# EAGLE schematic CCM_0015_Precision_HV_Amplifier (EAGLE 8.6.0)

## Sheet 1 of 2: CCM Subrack Bus
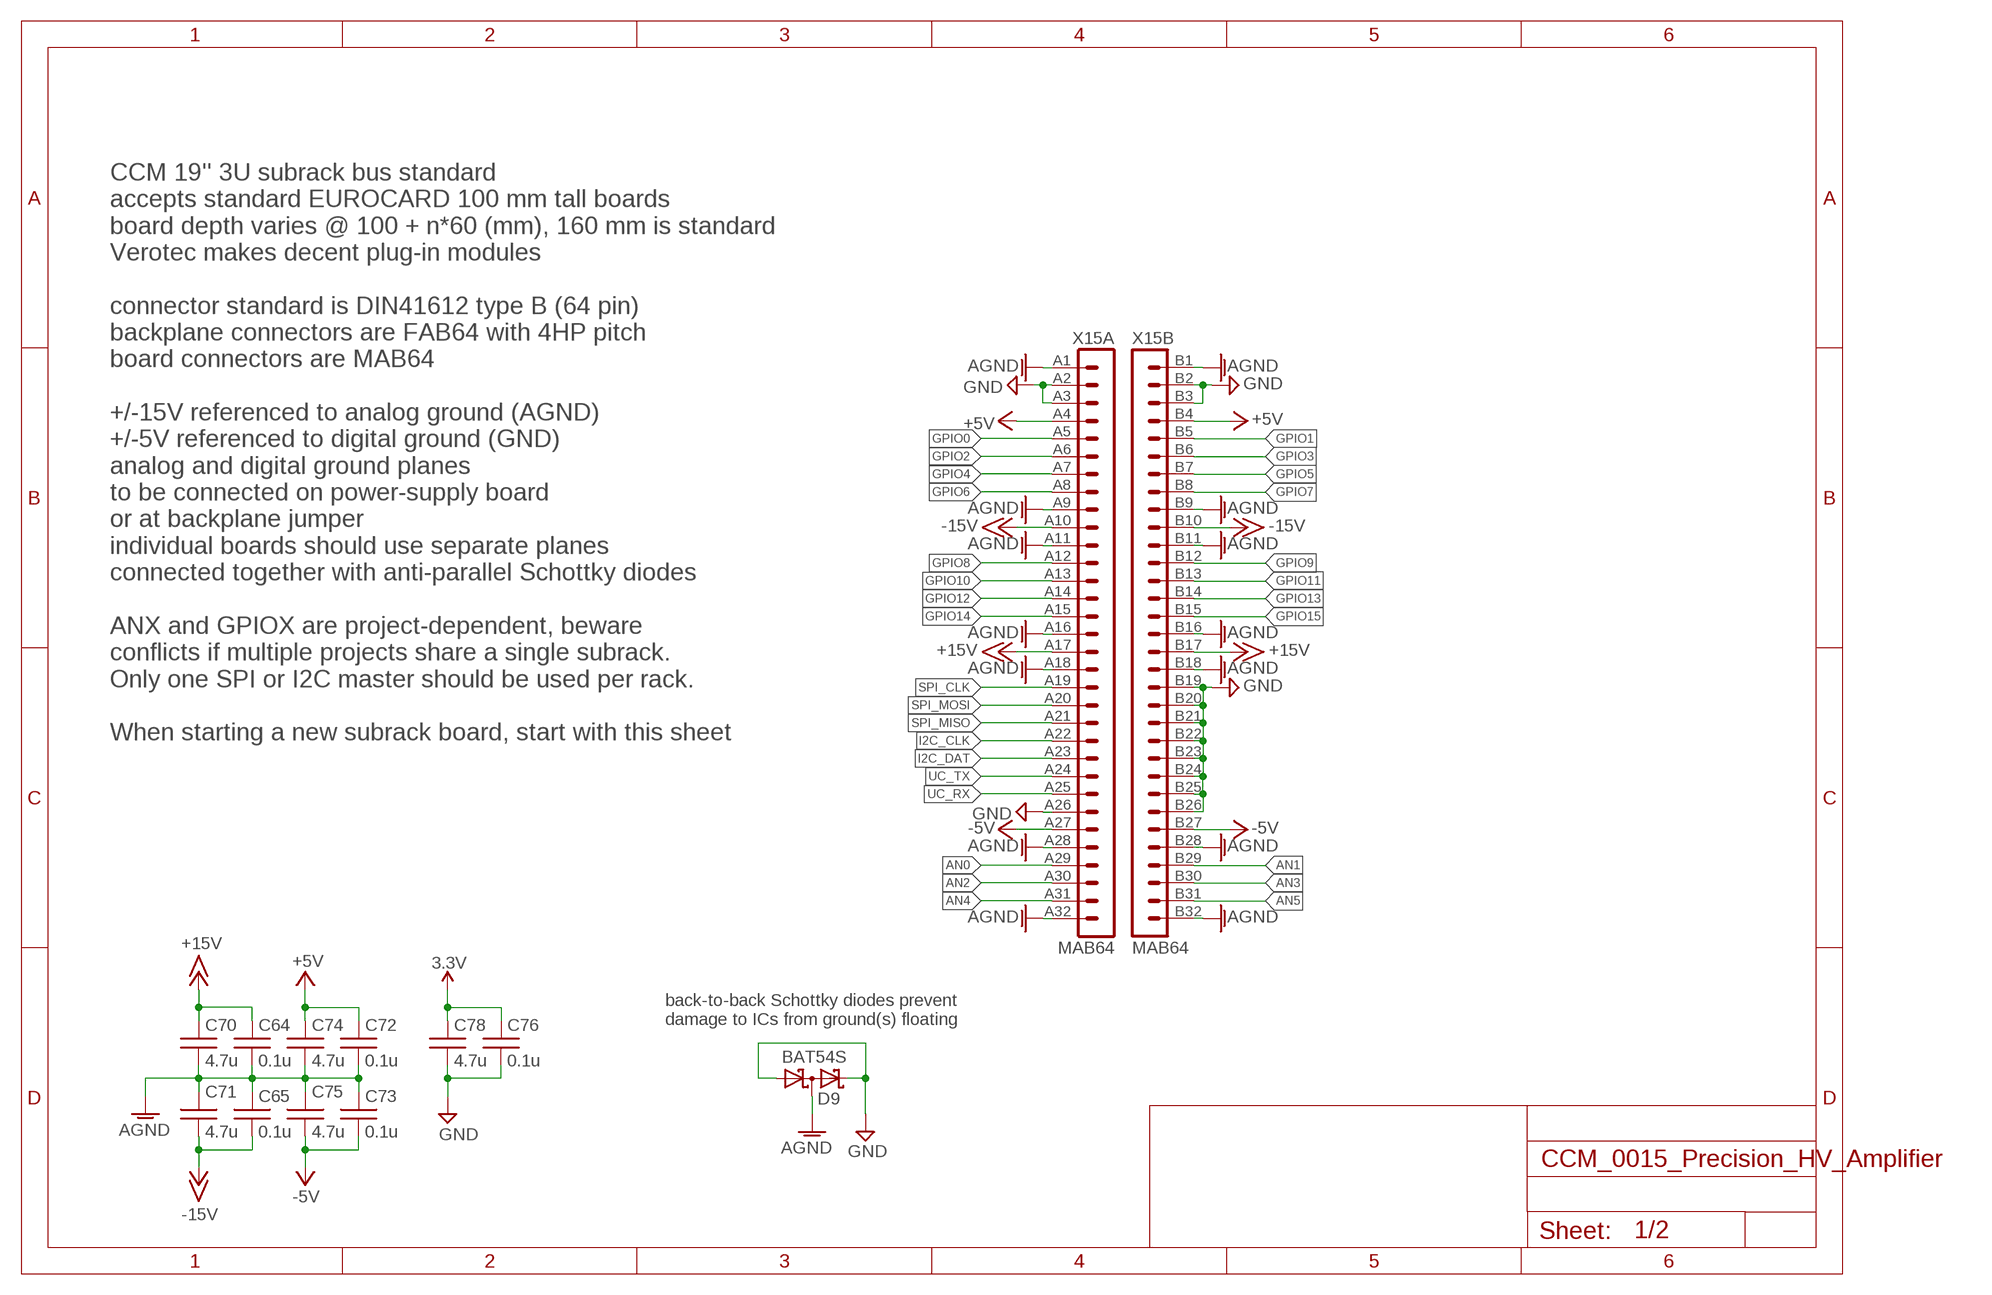
[diagram p0: schematic, sheet 1]

### Parts
C64  0.1u  C0603  [0603]
C65  0.1u  C0603  [0603]
C70  4.7u  C0603  [0603]
C71  4.7u  C0603  [0603]
C72  0.1u  C0603  [0603]
C73  0.1u  C0603  [0603]
C74  4.7u  C0603  [0603]
C75  4.7u  C0603  [0603]
C76  0.1u  C0603  [0603]
C78  4.7u  C0603  [0603]
D9  BAT54S  [SOT23]
X15  MAB64  [MAB64]

### Nets
3.3V: C76.1 C78.1
+5V: C72.1 C74.1 X15.A4 X15.B4
+15V: C64.1 C70.1 X15.A17 X15.B17 ; also sheet 2
-5V: C73.2 C75.2 X15.A27 X15.B27
-15V: C65.2 C71.2 X15.A10 X15.B10 ; also sheet 2
AGND: C64.2 C65.1 C70.2 C71.1 D9.3(C1A2) X15.A1 X15.A9 X15.A11 X15.A16 X15.A18 X15.A28 X15.A32 X15.B1 X15.B9 X15.B11 X15.B16 X15.B18 X15.B28 X15.B32 ; also sheet 2
AGND1: C72.2 C73.1 C74.2 C75.1
AN0: X15.A29
AN1: X15.B29
AN2: X15.A30
AN3: X15.B30
AN4: X15.A31
AN5: X15.B31
GND: C76.2 C78.2 D9.1(A1) D9.2(C2) X15.A2 X15.A3 X15.A26 X15.B2 X15.B3 X15.B19 X15.B20 X15.B21 X15.B22 X15.B23 X15.B24 X15.B25 X15.B26
GPIO0: X15.A5
GPIO1: X15.B5
GPIO2: X15.A6
GPIO3: X15.B6
GPIO4: X15.A7
GPIO5: X15.B7
GPIO6: X15.A8
GPIO7: X15.B8
GPIO8: X15.A12
GPIO9: X15.B12
GPIO10: X15.A13
GPIO11: X15.B13
GPIO12: X15.A14
GPIO13: X15.B14
GPIO14: X15.A15
GPIO15: X15.B15
I2C_CLK: X15.A22
I2C_DAT: X15.A23
SPI_CLK: X15.A19
SPI_MISO: X15.A21
SPI_MOSI: X15.A20
UC_RX: X15.A25
UC_TX: X15.A24

### Notes on the sheet
- CCM 19'' 3U subrack bus standard
  accepts standard EUROCARD 100 mm tall boards
  board depth varies @ 100 + n*60 (mm), 160 mm is standard
  Verotec makes decent plug-in modules
  
  connector standard is DIN41612 type B (64 pin)
  backplane connectors are FAB64 with 4HP pitch 
  board connectors are MAB64
  
  +/-15V referenced to analog ground (AGND)
  +/-5V referenced to digital ground (GND)
  analog and digital ground planes
  to be connected on power-supply board
  or at backplane jumper
  individual boards should use separate planes
  connected together with anti-parallel Schottky diodes
  
  ANX and GPIOX are project-dependent, beware 
  conflicts if multiple projects share a single subrack.
  Only one SPI or I2C master should be used per rack.
  
  When starting a new subrack board, start with this sheet
- back-to-back Schottky diodes prevent 
  damage to ICs from ground(s) floating

## Sheet 2 of 2: cavity drive
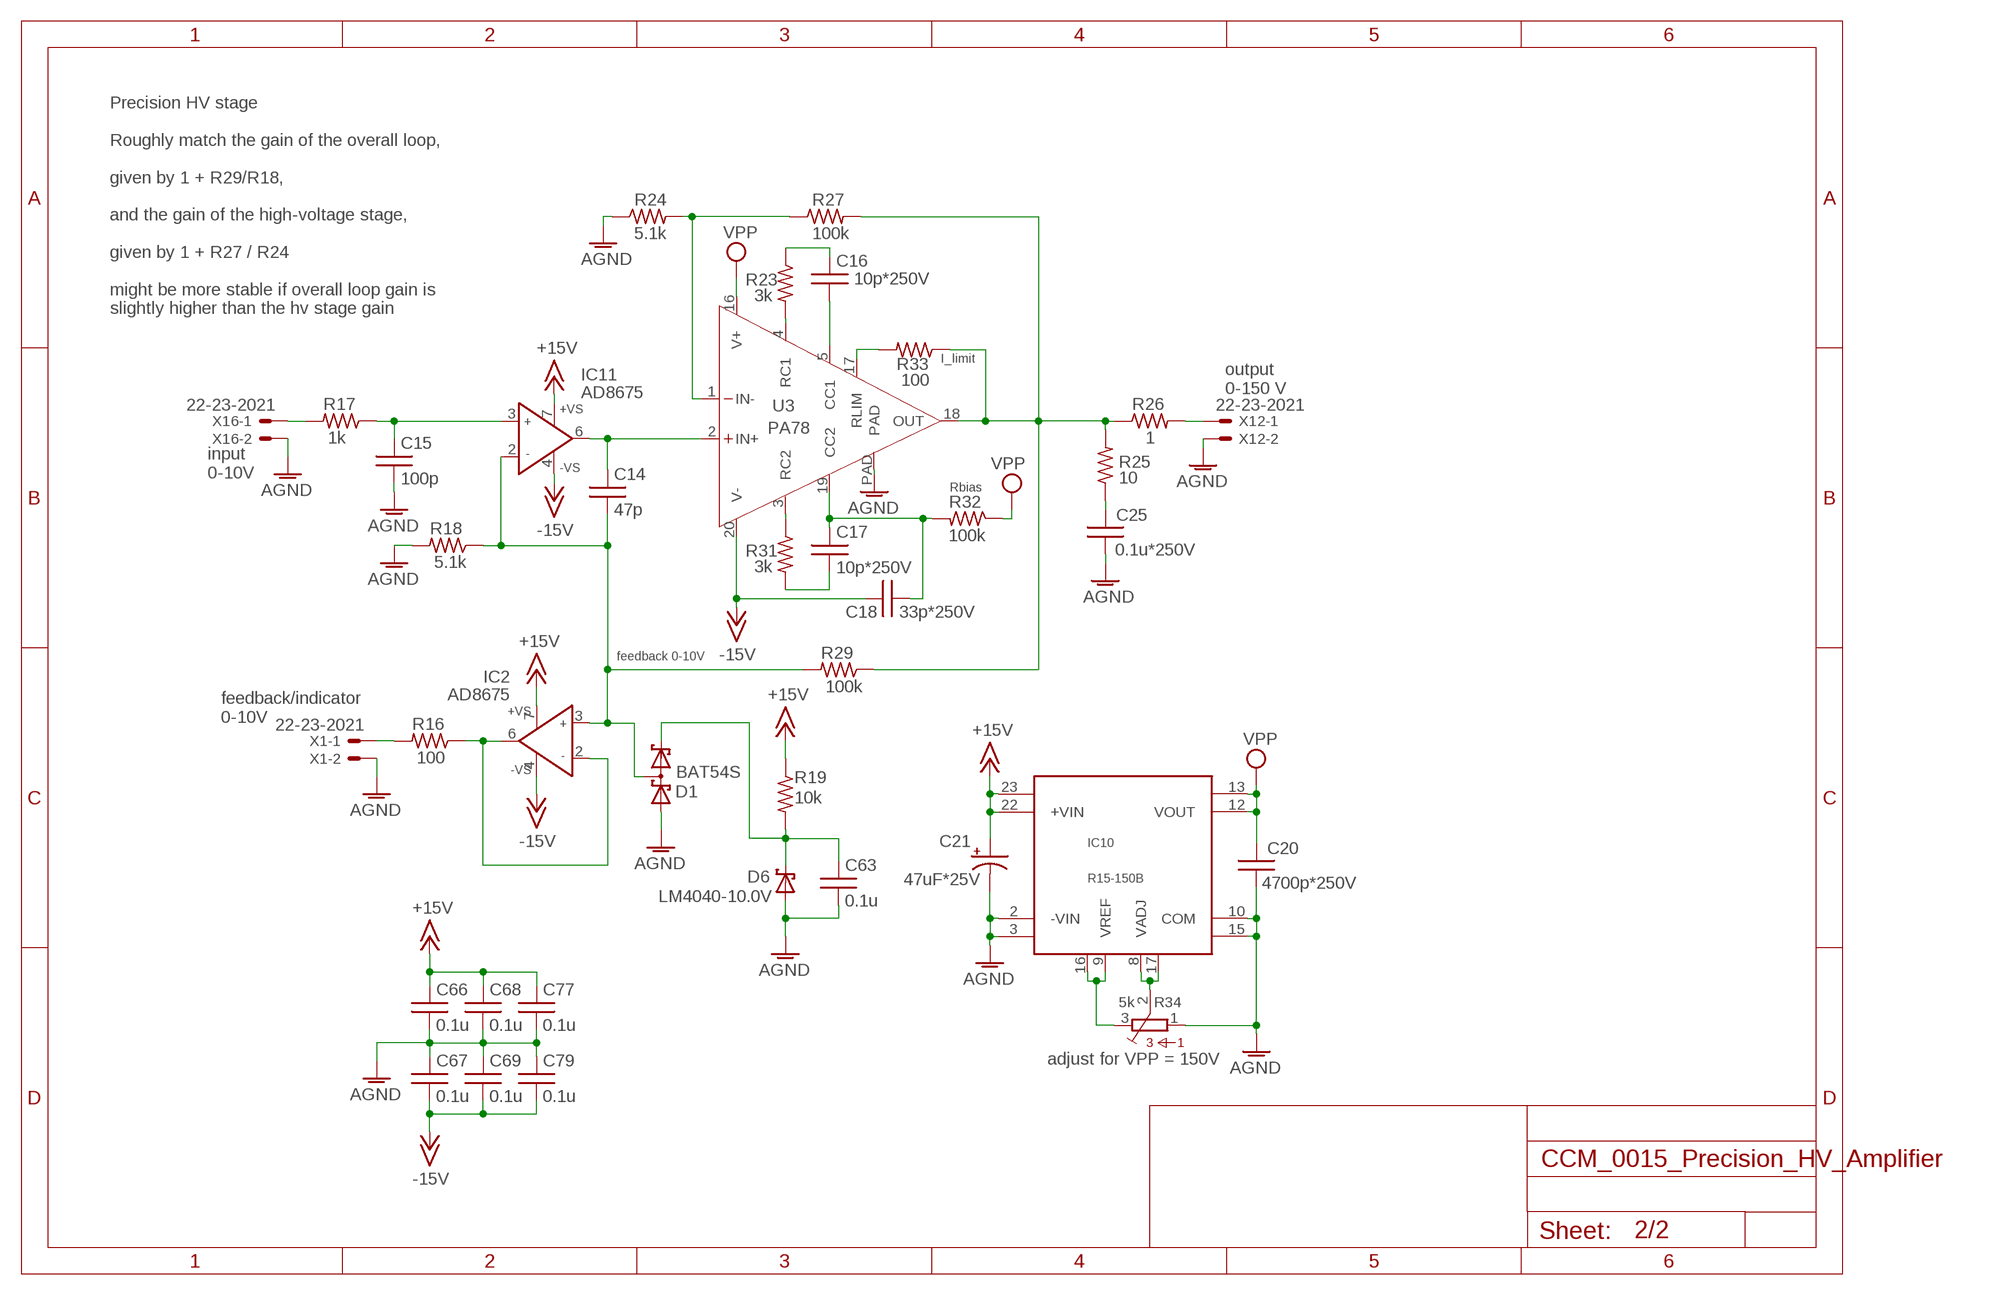
[diagram p1: schematic, sheet 2]

### Parts
C14  47p  C0603  [0603]
C15  100p  C0603  [0603]
C16  10p*250V  C0603  [0603]
C17  10p*250V  C0603  [0603]
C18  33p*250V  C0603  [0603]
C20  4700p*250V  CAPACITOR1210  [1210]
C21  47uF*25V  CAP_POL7343  [EIA7343]
C25  0.1u*250V  CAPACITOR1210  [1210]
C63  0.1u  C0603  [0603]
C66  0.1u  C0603  [0603]
C67  0.1u  C0603  [0603]
C68  0.1u  C0603  [0603]
C69  0.1u  C0603  [0603]
C77  0.1u  C0603  [0603]
C79  0.1u  C0603  [0603]
D1  BAT54S  [SOT23]
D6  LM4040-10.0V  LM4040  [SOT23]
IC2  AD8675  AD825_A  [SO08]
IC10  R15-150B  RXX100  [RXXDIP]
IC11  AD8675  AD825_A  [SO08]
R16  100  R0603  [0603]
R17  1k  R0603  [0603]
R18  5.1k  R0603  [0603]
R19  10k  R0603  [0603]
R23  3k  R0603  [0603]
R24  5.1k  R0603  [0603]
R25  10  RESISTOR2512  [2512]
R26  1  RESISTOR2512  [2512]
R27  100k  R0603  [0603]
R29  100k  R0603  [0603]
R31  3k  R0603  [0603]
R32  100k  R0603  [0603]
R33  100  R0603  [0603]
R34  5k  3386-H  [3386H]
U3  PA78  [PSOP-20]
X1  22-23-2021  [22-23-2021]
X12  22-23-2021  [22-23-2021]
X16  22-23-2021  [22-23-2021]

### Nets
+15V: C21.A(+) C66.1 C68.1 C77.1 IC2.7(+VS) IC10.22(+VIN) IC10.23(VIN2+) IC11.7(+VS) R19.1 ; also sheet 1
-15V: C18.2 C67.2 C69.2 C79.2 IC2.4(-VS) IC11.4(-VS) U3.20(V-) ; also sheet 1
AGND: C15.2 C20.2 C21.C(-) C25.2 C63.2 C66.2 C67.1 C68.2 C69.1 C77.2 C79.1 D1.1(A1) D6.2(A) IC10.2(-VIN) IC10.3(VIN2-) IC10.10(COM) IC10.15(COM2) R18.2 R24.1 R34.1 U3.PAD X12.2 X16.2 ; also sheet 1
CAVITY_DRIVE_RAW: C14.1 IC11.6(OUT) U3.2(IN+)
N$2: R16.2
N$5: IC2.2(IN-) IC2.6(OUT) R16.1
N$7: R17.2 X16.1
N$8: C63.1 D1.2(C2) D6.1(C) R19.2
N$20: C14.2 D1.3(C1A2) IC2.3(IN+) IC11.2(IN-) R18.1 R29.2
N$21: C15.1 IC11.3(IN+) R17.1
N$22: R26.2 X12.1
N$31: C16.1 R23.1
N$34: C25.1 R25.1
N$35: R33.2 U3.17(RLIM)
N$36: R25.2 R26.1 R27.2 R29.1 R33.1 U3.18(OUT)
N$37: R23.2 U3.4(RC1)
N$38: R24.2 R27.1 U3.1(IN-)
N$39: C16.2 U3.5(CC1)
N$42: R31.1 U3.3(RC2)
N$43: C17.1 C18.1 R32.2 U3.19(CC2)
N$44: C17.2 R31.2
N$45: IC10.9(VREF) IC10.16(VREF2) R34.3
N$46: IC10.8(VADJ) IC10.17(VADJ2) R34.2
VOUT2: C20.1 IC10.12(VOUT) IC10.13(VOUT2) ; supply symbol labelled VPP
VPP: R32.1 U3.16(V+)
Unconnected: X1.1 X1.2

### Notes on the sheet
- Precision HV stage
  
  Roughly match the gain of the overall loop,
  
  given by 1 + R29/R18, 
  
  and the gain of the high-voltage stage,
  
  given by 1 + R27 / R24
  
  might be more stable if overall loop gain is 
  slightly higher than the hv stage gain
- I_limit
- output
  0-150 V
- input
  0-10V
- Rbias
- feedback 0-10V
- feedback/indicator
  0-10V
- adjust for VPP = 150V

## Library data of the parts
C14-C18 C63-C79 = acrooptics:C: Capacitor
C20 C25 = noah:CAPACITOR
C21 = acrooptics:CAP_POL: Capacitor Polarized These are standard SMD and PTH capacitors. Normally 10uF, 47uF, and 100uF in electrolytic and tantalum varieties. Always verify the external diameter of the through hole cap, it varies with capacity, voltage, and manufacturer. The EIA devices should be standard.
D1 D9 = diode:BAT54S: Schottky Diodes Pin connection corrected 2011-05-04 Source: Fairchild .. BAT54.pdf
D6 = Fitch:LM4040: LM4040 Reference Zener Diode
IC2 IC11 = noah:AD825_A: Low Cost, General-Purpose High Speed JFET Amplifier Source: http://www.analog.com/static/imported-files/data_sheets/AD825.pdf
IC10 = custom_parts:RXX100: Innoline Rxx-100_150B DC/DC converters
R16-R19 R23 R24 R27 R29 R31-R33 = acrooptics:R: 0603 resistor
R25 R26 = noah:RESISTOR: RESISTOR, American symbol
R34 = bourns:3386-: 3386 Series 3/8" Square Trimmer
U3 = noah:PA78
X1 X12 X16 = con-molex:22-23-2021: .100" (2.54mm) Center Header - 2 Pin; MF: MOLEX; MPN: 22-23-2021; OC_FARNELL: 1462926; OC_NEWARK: 25C3832
X15 = noah:MAB64: CONNECTOR male, 94 pins, type B, rows AB, grid 2.54 mm

## Net classes
1 standard: width 0.61 mm, clearance 0.254 mm